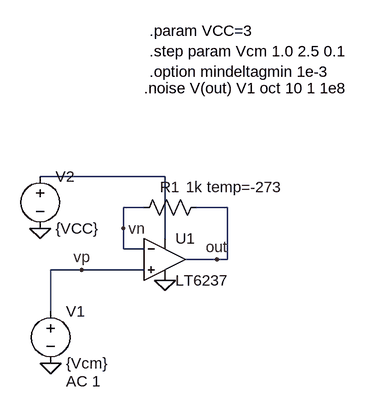
[diagram p0: schematic lt6237_cmr_noise.asc]
lt6237_cmr_noise.asc, the LTspice schematic file:
Version 4
SHEET 1 880 680
WIRE 192 16 0 16
WIRE 160 64 128 64
WIRE 288 64 240 64
WIRE 128 96 128 64
WIRE 192 112 192 16
WIRE 128 128 128 96
WIRE 160 128 128 128
WIRE 272 144 224 144
WIRE 288 144 288 64
WIRE 288 144 272 144
WIRE 64 160 16 160
WIRE 160 160 64 160
WIRE 16 224 16 160
FLAG 0 96 0
FLAG 16 304 0
FLAG 192 176 0
FLAG 272 144 out
FLAG 64 160 vp
FLAG 128 96 vn
SYMBOL Opamps\\LT6237 192 144 R0
SYMATTR InstName U1
SYMBOL voltage 16 208 R0
WINDOW 123 24 124 Left 2
WINDOW 39 0 0 Left 2
SYMATTR InstName V1
SYMATTR Value {Vcm}
SYMATTR Value2 AC 1
SYMBOL voltage 0 0 R0
WINDOW 123 0 0 Left 2
WINDOW 39 0 0 Left 2
SYMATTR InstName V2
SYMATTR Value {VCC}
SYMBOL res 256 48 R90
WINDOW 0 0 56 VBottom 2
WINDOW 3 -31 -43 VTop 2
SYMATTR InstName R1
SYMATTR Value 1k temp=-273
TEXT 160 -120 Left 2 !.noise V(out) V1 oct 10 1 1e8
TEXT 168 -208 Left 2 !.param VCC=3\n.step param Vcm 1.0 2.5 0.1\n.option mindeltagmin 1e-3

The netlist it stands for:
* lt6237_cmr_noise.asc
* U1: LT6237 (symbol Opamps\LT6237 not available, pins judged from their places): In+=vp In-=vn V+=N001 V-=0 OUT=out
V1 vp 0 {Vcm} AC 1
V2 N001 0 {VCC}
R1 out vn 1k temp=-273
.noise V(out) V1 oct 10 1 1e8
.param VCC=3
.step param Vcm 1.0 2.5 0.1
.option mindeltagmin 1e-3
.backanno
.end